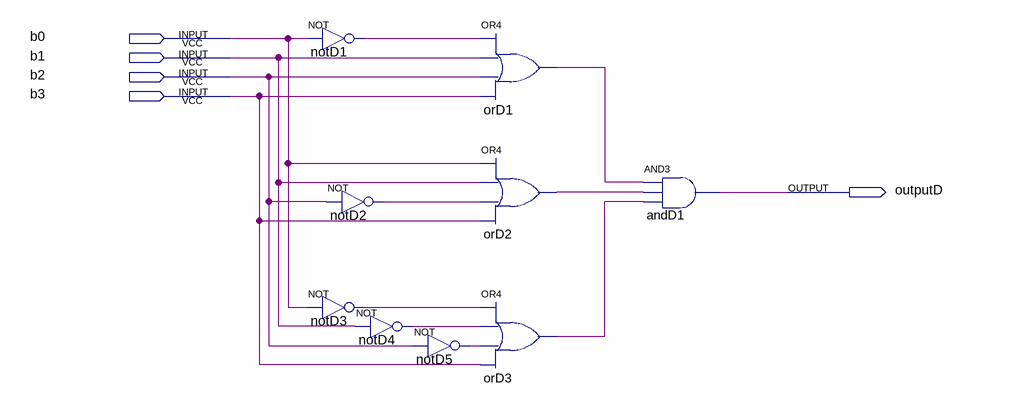
[diagram p0: schematic sheet]
// Quartus schematic d.bdf as structural Verilog: 9 symbols, 5 pins
module d (
  input  b0,
  input  b1,
  input  b2,
  input  b3,
  output outputD
);

  wire notD1_out, notD2_out, notD3_out, notD4_out, notD5_out, orD1_out, orD2_out, orD3_out;

  not notD1 (notD1_out, b0);
  not notD2 (notD2_out, b2);
  not notD3 (notD3_out, b0);
  not notD4 (notD4_out, b1);
  not notD5 (notD5_out, b2);
  or orD1 (orD1_out, notD1_out, b1, b2, b3);
  or orD2 (orD2_out, b0, b1, notD2_out, b3);
  or orD3 (orD3_out, notD3_out, notD4_out, notD5_out, b3);
  and andD1 (outputD, orD1_out, orD2_out, orD3_out);
endmodule
